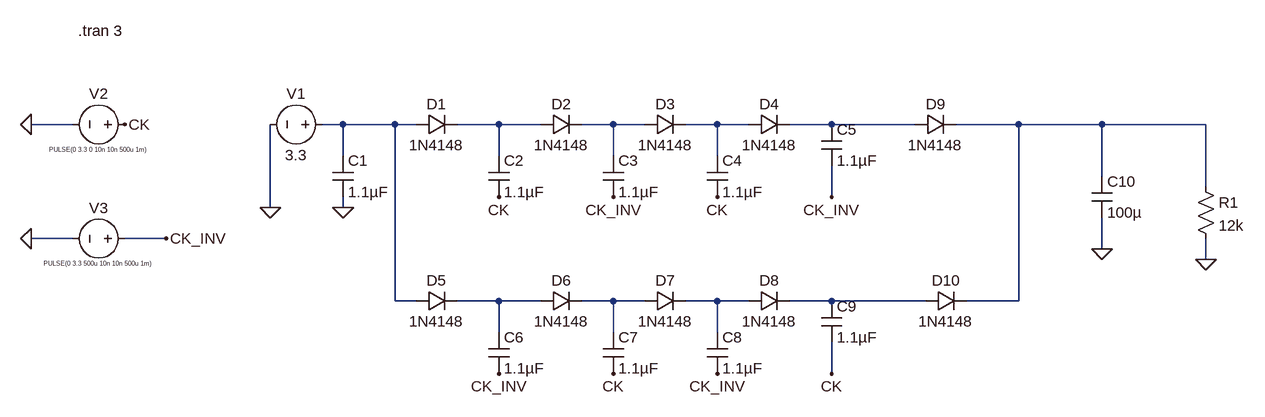
[diagram p0: schematic dickson_double.asc]
dickson_double.asc, the LTspice schematic file:
Version 4
SHEET 1 1652 728
WIRE -160 144 -224 144
WIRE 256 144 224 144
WIRE 336 144 256 144
WIRE 368 144 336 144
WIRE 496 144 432 144
WIRE 560 144 496 144
WIRE 672 144 624 144
WIRE 720 144 672 144
WIRE 832 144 784 144
WIRE 880 144 832 144
WIRE 1008 144 944 144
WIRE 1136 144 1008 144
WIRE 1296 144 1200 144
WIRE 1424 144 1296 144
WIRE 1584 144 1424 144
WIRE 256 192 256 144
WIRE 496 192 496 144
WIRE 672 192 672 144
WIRE 832 192 832 144
WIRE 1424 224 1424 144
WIRE 1584 240 1584 144
WIRE 1008 256 1008 208
WIRE 144 272 144 144
WIRE 256 272 256 256
WIRE -160 320 -224 320
WIRE -16 320 -80 320
WIRE 1424 336 1424 288
WIRE 1584 352 1584 320
WIRE 336 416 336 144
WIRE 368 416 336 416
WIRE 496 416 432 416
WIRE 560 416 496 416
WIRE 672 416 624 416
WIRE 720 416 672 416
WIRE 832 416 784 416
WIRE 880 416 832 416
WIRE 1008 416 944 416
WIRE 1152 416 1008 416
WIRE 1296 416 1296 144
WIRE 1296 416 1216 416
WIRE 496 464 496 416
WIRE 672 464 672 416
WIRE 832 464 832 416
WIRE 1008 528 1008 480
FLAG 144 272 0
FLAG -224 320 0
FLAG -224 144 0
FLAG 496 256 CK
FLAG 832 256 CK
FLAG 672 256 CK_INV
FLAG 1008 256 CK_INV
FLAG 496 528 CK_INV
FLAG 832 528 CK_INV
FLAG 672 528 CK
FLAG 1008 528 CK
FLAG 256 272 0
FLAG 1424 336 0
FLAG 1584 352 0
FLAG -80 144 CK
FLAG -16 320 CK_INV
SYMBOL voltage 240 144 R90
WINDOW 0 -32 56 VBottom 2
WINDOW 3 32 56 VTop 2
WINDOW 123 0 0 Left 0
WINDOW 39 0 0 Left 0
SYMATTR InstName V1
SYMATTR Value 3.3
SYMBOL voltage -64 144 R90
WINDOW 0 -32 56 VBottom 2
WINDOW 3 32 56 VTop 0
WINDOW 123 0 0 Left 0
WINDOW 39 0 0 Left 0
SYMATTR InstName V2
SYMATTR Value PULSE(0 3.3 0 10n 10n 500u 1m)
SYMBOL voltage -64 320 R90
WINDOW 0 -32 56 VBottom 2
WINDOW 3 32 56 VTop 0
WINDOW 123 0 0 Left 0
WINDOW 39 0 0 Left 0
SYMATTR InstName V3
SYMATTR Value PULSE(0 3.3 500u 10n 10n 500u 1m)
SYMBOL diode 368 160 R270
WINDOW 0 32 32 VTop 2
WINDOW 3 0 32 VBottom 2
SYMATTR InstName D1
SYMATTR Value 1N4148
SYMBOL diode 560 160 R270
WINDOW 0 32 32 VTop 2
WINDOW 3 0 32 VBottom 2
SYMATTR InstName D2
SYMATTR Value 1N4148
SYMBOL diode 720 160 R270
WINDOW 0 32 32 VTop 2
WINDOW 3 0 32 VBottom 2
SYMATTR InstName D3
SYMATTR Value 1N4148
SYMBOL diode 880 160 R270
WINDOW 0 32 32 VTop 2
WINDOW 3 0 32 VBottom 2
SYMATTR InstName D4
SYMATTR Value 1N4148
SYMBOL cap 240 192 R0
SYMATTR InstName C1
SYMATTR Value 1.1µF
SYMBOL cap 480 192 R0
SYMATTR InstName C2
SYMATTR Value 1.1µF
SYMBOL cap 656 192 R0
SYMATTR InstName C3
SYMATTR Value 1.1µF
SYMBOL cap 816 192 R0
SYMATTR InstName C4
SYMATTR Value 1.1µF
SYMBOL cap 992 144 R0
SYMATTR InstName C5
SYMATTR Value 1.1µF
SYMBOL diode 368 432 R270
WINDOW 0 32 32 VTop 2
WINDOW 3 0 32 VBottom 2
SYMATTR InstName D5
SYMATTR Value 1N4148
SYMBOL diode 560 432 R270
WINDOW 0 32 32 VTop 2
WINDOW 3 0 32 VBottom 2
SYMATTR InstName D6
SYMATTR Value 1N4148
SYMBOL diode 720 432 R270
WINDOW 0 32 32 VTop 2
WINDOW 3 0 32 VBottom 2
SYMATTR InstName D7
SYMATTR Value 1N4148
SYMBOL diode 880 432 R270
WINDOW 0 32 32 VTop 2
WINDOW 3 0 32 VBottom 2
SYMATTR InstName D8
SYMATTR Value 1N4148
SYMBOL cap 480 464 R0
SYMATTR InstName C6
SYMATTR Value 1.1µF
SYMBOL cap 656 464 R0
SYMATTR InstName C7
SYMATTR Value 1.1µF
SYMBOL cap 816 464 R0
SYMATTR InstName C8
SYMATTR Value 1.1µF
SYMBOL cap 992 416 R0
SYMATTR InstName C9
SYMATTR Value 1.1µF
SYMBOL diode 1136 160 R270
WINDOW 0 32 32 VTop 2
WINDOW 3 0 32 VBottom 2
SYMATTR InstName D9
SYMATTR Value 1N4148
SYMBOL diode 1152 432 R270
WINDOW 0 32 32 VTop 2
WINDOW 3 0 32 VBottom 2
SYMATTR InstName D10
SYMATTR Value 1N4148
SYMBOL cap 1408 224 R0
SYMATTR InstName C10
SYMATTR Value 100µ
SYMBOL res 1568 224 R0
SYMATTR InstName R1
SYMATTR Value 12k
TEXT -152 0 Left 2 !.tran 3

The netlist it stands for:
* dickson_double.asc
V1 N001 0 3.3
V2 CK 0 PULSE(0 3.3 0 10n 10n 500u 1m)
V3 CK_INV 0 PULSE(0 3.3 500u 10n 10n 500u 1m)
D1 N001 N002 1N4148
D2 N002 N003 1N4148
D3 N003 N004 1N4148
D4 N004 N005 1N4148
C1 N001 0 1.1µF
C2 N002 CK 1.1µF
C3 N003 CK_INV 1.1µF
C4 N004 CK 1.1µF
C5 N005 CK_INV 1.1µF
D5 N001 N007 1N4148
D6 N007 N008 1N4148
D7 N008 N009 1N4148
D8 N009 N010 1N4148
C6 N007 CK_INV 1.1µF
C7 N008 CK 1.1µF
C8 N009 CK_INV 1.1µF
C9 N010 CK 1.1µF
D9 N005 N006 1N4148
D10 N010 N006 1N4148
C10 N006 0 100µ
R1 N006 0 12k
.model D D
.lib standard.dio
.tran 3
.backanno
.end